# Altium schematic sheet Smart_Battery_main.SchDoc: Smart_Battery
size A4; Author: Dj140; DrawnBy: Dj140
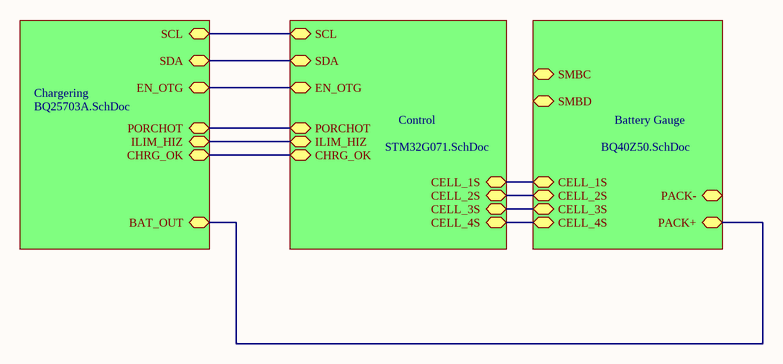
[diagram p0: Smart_Battery_main.SchDoc]

## Sub-sheets
Battery Gauge = BQ40Z50.SchDoc: PACK+, CELL_4S, CELL_3S, CELL_2S, CELL_1S, PACK-, SMBC, SMBD
Chargering = BQ25703A.SchDoc: SCL, SDA, EN_OTG, ILIM_HIZ, BAT_OUT, CHRG_OK, PORCHOT
Control = STM32G071.SchDoc: SCL, SDA, EN_OTG, ILIM_HIZ, PORCHOT, CHRG_OK, CELL_1S, CELL_2S, CELL_3S, CELL_4S

## Nets
(unnamed): sheet Battery Gauge/PACK+, sheet Chargering/BAT_OUT
(unnamed): sheet Battery Gauge/CELL_4S, sheet Control/CELL_4S
(unnamed): sheet Battery Gauge/CELL_3S, sheet Control/CELL_3S
(unnamed): sheet Battery Gauge/CELL_2S, sheet Control/CELL_2S
(unnamed): sheet Battery Gauge/CELL_1S, sheet Control/CELL_1S
(unnamed): sheet Chargering/SCL, sheet Control/SCL
(unnamed): sheet Chargering/SDA, sheet Control/SDA
(unnamed): sheet Chargering/EN_OTG, sheet Control/EN_OTG
(unnamed): sheet Chargering/ILIM_HIZ, sheet Control/ILIM_HIZ
(unnamed): sheet Chargering/CHRG_OK, sheet Control/CHRG_OK
(unnamed): sheet Chargering/PORCHOT, sheet Control/PORCHOT